# EAGLE design POTENCIOMETRO (EAGLE 9.6.2)
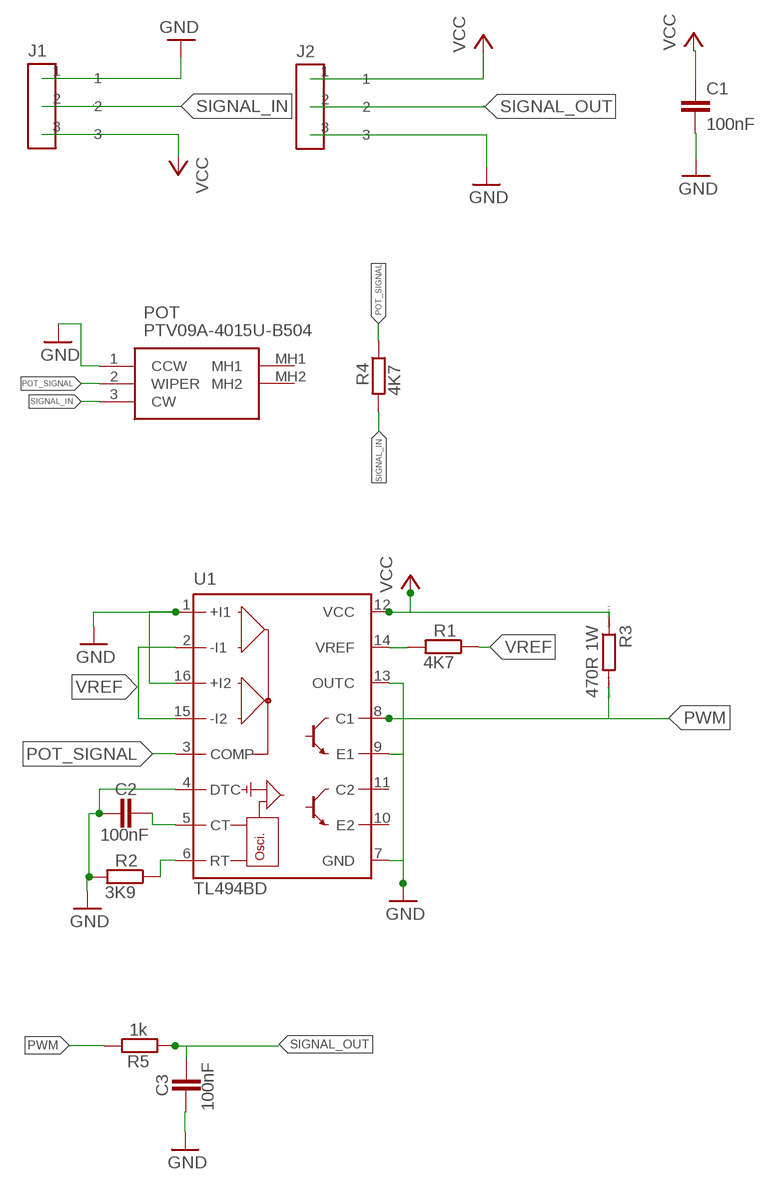
[diagram p0: schematic, sheet 1]

## Parts
C1  100nF  C-EUC0805  [C0805]
C2  100nF  C-EUC0805  [C0805]
C3  100nF  C-EUC0805  [C0805]
J1  CONECTOR_MACHO  [MALE]
J2  CONECTOR_FEMEA  [FEMALE]
POT  PTV09A-4015U-B504  [PTV09A4015UB104]
R1  4K7  R-EU_R0805W  [R0805W]
R2  3K9  R-EU_R0805W  [R0805W]
R3  470R 1W  RR2512  [R2512]
R4  4K7  R-EU_R0805W  [R0805W]
R5  1k  R-EU_R0805W  [R0805W]
U1  TL494BD  [SO16]

## Nets
GND: C1.2 C2.1 C3.1 J1.1 J2.3 POT.1(CCW) R2.2 U1.1(+I1) U1.4(DTC) U1.7(GND) U1.9(E1) U1.13(OUTC) U1.16(+I2)
N$2: C2.2 U1.5(CT)
N$3: R1.2 U1.14(VREF)
N$4: R2.1 U1.6(RT)
POT_SIGNAL: POT.2(WIPER) R4.1 U1.3(COMP)
PWM: R3.2 R5.1 U1.8(C1)
SIGNAL_IN: J1.2 POT.3(CW) R4.2
SIGNAL_OUT: C3.2 J2.2 R5.2
VCC: C1.1 J1.3 J2.1 R3.1 U1.12(VCC)
VREF: R1.1 U1.2(-I1) U1.15(-I2)
Unconnected: POT.MH1 POT.MH2 U1.10(E2) U1.11(C2)

## Library data of the parts
C1-C3 = rcl:C-EU: CAPACITOR, European symbol; SPICEPREFIX: C
J1 = Eletroblocks Lib:CONECTOR_MACHO
J2 = Eletroblocks Lib:CONECTOR_FEMEA
POT = PTV09A-4015U-B504:PTV09A-4015U-B504: Potentiometers PANEL CONTROL - 9MM-ST-CA Source: Datasheet <https://www.mouser.in/datasheet/2/54/ptv09-777818.pdf>; ARROW_PART_NUMBER: PTV09A-4015U-B504; DESCRIPTION: Potentiometers PANEL CONTROL - 9MM-ST-CA; HEIGHT: 15.5mm; MANUFACTURER_NAME: Bourns; MANUFACTURER_PART_NUMBER: PTV09A-4015U-B504; MOUSER_PART_NUMBER: 652-PTV09A-4015UB504; MOUSER_PRICE-STOCK: https://www.mouser.co.uk/ProductDetail/Bourns/PTV09A-4015U-B504?qs=pxDZlBjcsCherlTtJcuegw%3D%3D
R1 R2 R4 R5 = rcl:R-EU_: RESISTOR, European symbol; SPICEPREFIX: R
R3 = eagle-ltspice:R: RESISTOR, European symbol; SPICEMODEL: NONE; SPICEPREFIX: R
U1 = linear:TL494*: SWITCHMODE Pulse Width Modulation Control Circuit NCV494B http://onsemi.com tl494-d.pdf

## Board
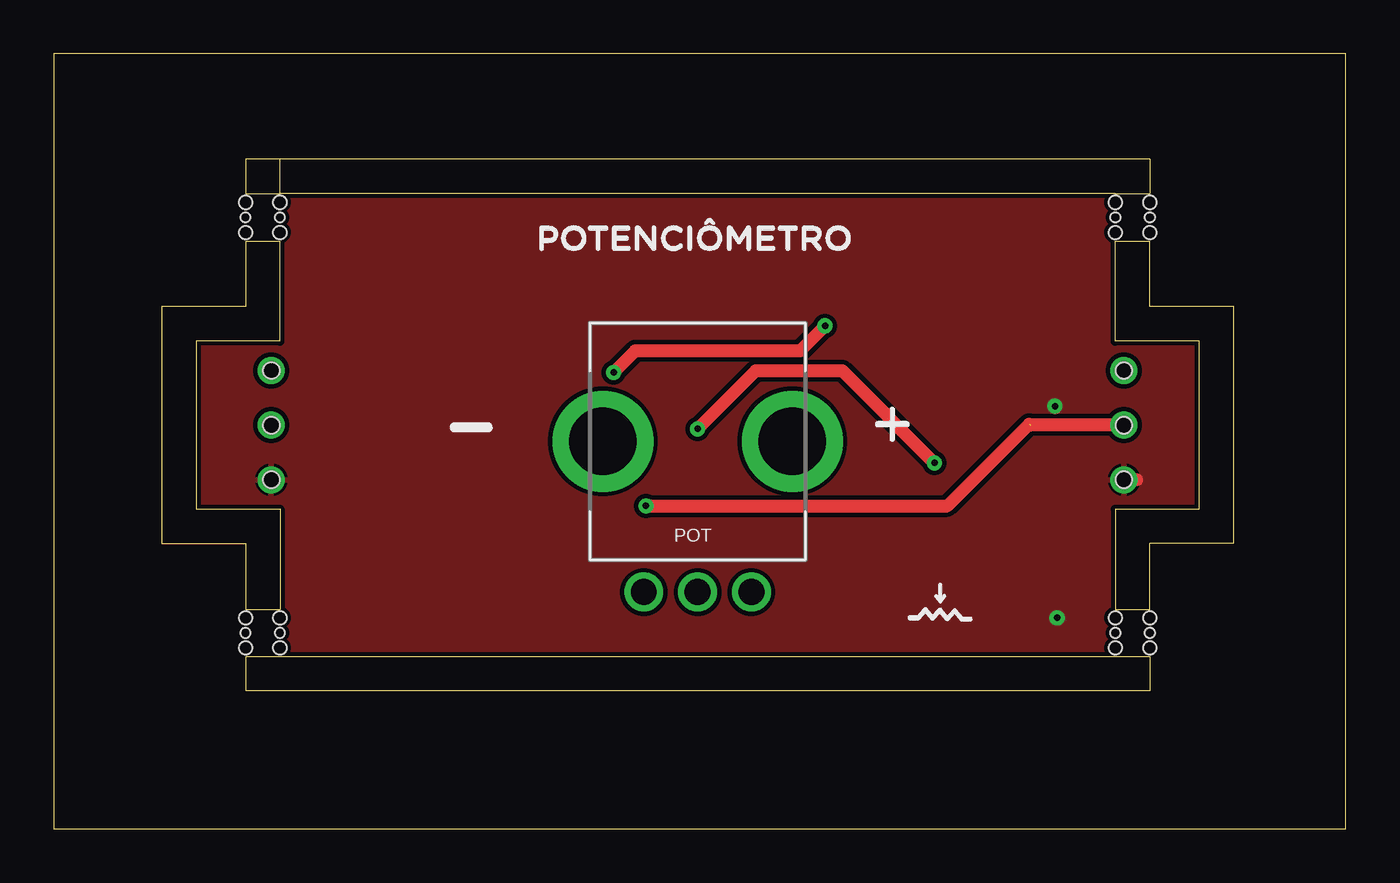
[diagram p1: board, top side]
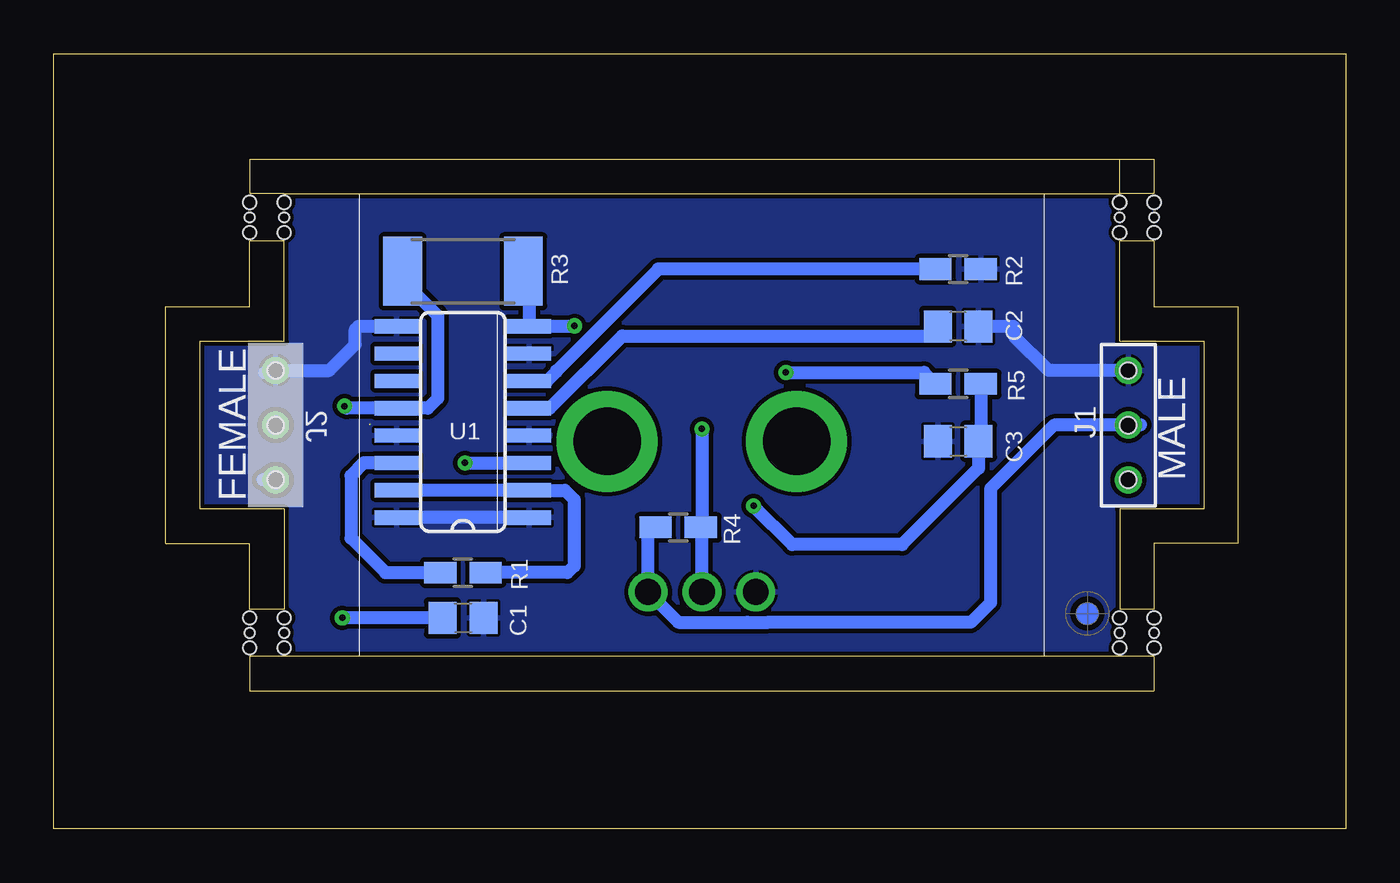
[diagram p2: board, bottom side, seen from below]

Size 60 x 36 mm. Coordinates in mm from the lower left corner, seen from the top.
Outline: 10.5,8 49.3,8
Outline: 49.3,29.5 10.5,29.5 10.5,31.1
Outline: 8.9,8 8.9,6.4 50.9,6.4 50.9,8
Outline: 8.9,27.3 8.9,24.25 5,24.25 5,13.25 8.9,13.25 8.9,10.2
Outline: 10.5,31.1 8.9,31.1 8.9,29.5
Outline: 50.9,10.2 50.9,13.25 54.8,13.25 54.8,24.25 50.9,24.25 50.9,27.3
Outline: 50.9,29.5 50.9,31.1 10.5,31.1
Outline: 10.5,27.3 10.5,22.65 6.6,22.65 6.6,14.85 10.5,14.85 10.5,10.2
Outline: 49.3,27.3 49.3,22.65 53.2,22.65 53.2,14.85 49.3,14.85 49.3,10.2
Outline: 0,36 0,0 60,0 60,36 0,36
Copper layers (1*16): Top 0.035mm / dielectric 1.5mm / Bottom 0.035mm
Design rules "default *": minimum track width 6mil, minimum drill 0.35mm, track to track 8mil, track to pad 8mil, pad to pad 8mil, via to via 8mil, smd to smd 8mil, copper to edge 8mil, drill to drill 8mil, minimum pad ring 10mil, minimum via ring 8mil, stop-mask expansion 4mil, vias tented up to drill 1mm, thermal gap 5mil

### Footprints (pad centres in the part's own frame; a part is rotated, then mirrored left to right if it is on the bottom)
C0805 = smd 1.3 x 1.5: 1 -0.95,0; 2 0.95,0
MALE = drill 0.75: 1 0,2.54; 2 0,0; 3 0,-2.54 | hole 0.75: 0,2.54; 0,0; 0,-2.54
FEMALE = drill 0.75: 1 0,2.54; 2 0,0; 3 0,-2.54 | hole 0.75: 0,2.54; 0,0; 0,-2.54
PTV09A4015UB104 = drill 1.2 pad 1.8: 1 0,0; 2 2.5,0; 3 5,0 | drill 3.124 pad 4.686: MH1 -1.9,7; MH2 6.9,7
R0805W = smd 1.5 x 1: 1 -1.052,0; 2 1.052,0
R2512 = smd 1.8 x 3.2: 1 -2.8,0; 2 2.8,0
SO16 = smd 0.66 x 2.032: 1 -4.445,-3.073; 2 -3.175,-3.073; 3 -1.905,-3.073; 4 -0.635,-3.073; 5 0.635,-3.073; 6 1.905,-3.073; 7 3.175,-3.073; 8 4.445,-3.073; 9 4.445,3.073; 10 3.175,3.073; 11 1.905,3.073; 12 0.635,3.073; 13 -0.635,3.073; 14 -1.905,3.073; 15 -3.175,3.073; 16 -4.445,3.073
STAMP_DUPLO = hole 0.45: 0,0; 0,-1.6 | hole 0.6: 0.7,0; -0.7,0; 0.7,-1.6; -0.7,-1.6

### Placement (x,y rotation side)
C1  41,9.8 0 bottom
C2  18,23.33 180 bottom
C3  18,18 0 bottom
J1  10.1,18.75 0 top
J2  49.7,18.75 180 top
POT  27.4,11 0 top
R1  41,11.9 180 bottom
R2  18,26 0 bottom
R3  41,25.9 0 bottom
R4  31,14 180 bottom
R5  18,20.67 0 bottom
U1  41,18.9 90 bottom
U$1  [FIDUCIAL_G10]  12,10 0 bottom
U$2  [STAMP_DUPLO]  8.9,9.1 90 top
U$3  [STAMP_DUPLO]  8.9,28.4 90 top
U$4  [STAMP_DUPLO]  49.3,28.4 90 top
U$5  [STAMP_DUPLO]  49.3,9.1 90 top

### Tracks (layer width: path | path; a pad name or v marks a point on that pad's centre or on a via)
GND
  Bottom 0.61: 50.2,21.19 J2.3 47.21,21.29 46,22.5 46,23.2 45.86,23.34 U1.9 | U1.1 U1.16 | J1.1 13.79,21.29 15.4,22.9 15.4,23.3 15.43,23.33 C2.1
  pour Bottom: 4.03,7.96 4.03,29.48 54.4,29.48 54.4,7.96
N$2
  Bottom 0.61: C2.2 19.38,22.9 33.6,22.9 36.97,19.54 U1.5
N$3
  Bottom 0.61: U1.14 45.61,16.99 46.2,16.4 46.2,13.5 44.6,11.9 R1.2
N$4
  Bottom 0.61: R2.1 31.93,26 36.66,21.27 36.66,21.23 37.09,20.8 U1.6
POT_SIGNAL  (via drill 0.3)
  Top 0.61: v40.9,17 36.62,21.28 32.6,21.28 v29.9,18.58
  Bottom 0.61: U1.3 v40.9,17 | POT.2 29.9,13.35 R4.1 29.9,14.05 v29.9,18.58
PWM  (via drill 0.3)
  Top 0.61: v35.82,23.36 34.66,22.2 27,22.2 v26,21.2
  Bottom 0.61: R3.2 37.93,25.63 U1.8 35.84,23.34 v35.82,23.36 | v26,21.2 19.59,21.2 R5.1
SIGNAL_IN
  Bottom 0.61: 9.53,18.77 J1.2 13.55,18.75 16.5,15.8 16.5,10.5 17.41,9.59 26.82,9.59 | 26.82,9.59 26.81,9.6 | 26.82,9.59 27.8,9.59 30.99,9.59 POT.3 32.4,13.75 R4.2
SIGNAL_OUT  (via drill 0.3)  (1 unrouted)
  Top 0.61: v27.5,15 41.5,15 45.3,18.8 | J2.2 45.35,18.75
  Bottom 0.61: R5.2 16.95,18.1 C3.2 17.05,16.75 20.6,13.2 25.7,13.2 v27.5,15
VCC  (via drill 0.3)
  Top 0.61: J2.1 50.3,16.21 | v46.5,19.64 46.5,19.56
  Bottom 0.61: C1.1 42.28,9.89 | R3.1 43.58,25.81 | R3.1 43.8,25.46 42.17,23.83 42.17,19.99 42.62,19.54 U1.12 46.4,19.54 v46.5,19.64 | 41.99,9.76 C1.1 | C1.1 42.07,9.68 | J2.1 50.3,16.21 | 43.4,25.5 R3.1 | C1.1 v46.6,9.8
  pour Top: 4,6 56,6 56,32 4,32
VREF
  Bottom 0.61: U1.15 U1.2 36.27,15.72 35.84,15.3 35.84,12.2 36.14,11.9 R1.1

### Text on the board
tStop: V1.1.1
bStop: V1.1.1